# EAGLE design main (EAGLE 6.1)
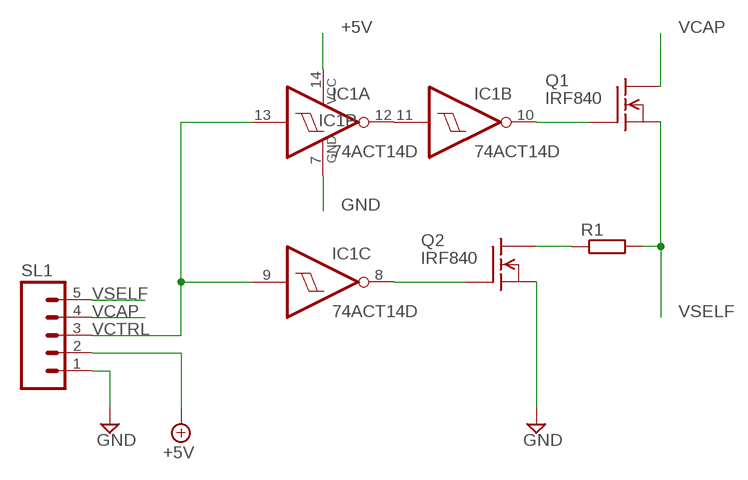
[diagram p0: schematic, sheet 1]

## Parts
IC1  74ACT14D  [SO14]
Q1  IRF840  [TO220]
Q2  IRF840  [TO220]
R1  R-EU_0204/5  [0204/5]
SL1  M05  [05P]

## Nets
+5V: IC1.14(P:VCC) SL1.2
GND: IC1.7(P:GND) Q2.3(S) SL1.1
N$1: IC1.11(B:I) IC1.12(A:O)
N$2: IC1.8(C:O) Q2.1(G)
N$3: IC1.10(B:O) Q1.1(G)
N$6: Q2.2(D) R1.1
VCAP: Q1.2(D) SL1.4
VCTRL: IC1.9(C:I) IC1.13(A:I) SL1.3
VSELF: Q1.3(S) R1.2 SL1.5
Unconnected: IC1.1(D:I) IC1.2(D:O) IC1.3(E:I) IC1.4(E:O) IC1.5(F:I) IC1.6(F:O)

## Library data of the parts
IC1 = 74xx-eu:74*14: Hex schmitt trigger INVERTER
Q1 Q2 = transistor-fet:IRF840: N-Channel Enhancement MOSFET (HEXFET); 500V; 8A; 0,85Ohm
R1 = rcl:R-EU_: RESISTOR, European symbol
SL1 = con-amp-quick:M05: AMP QUICK CONNECTOR; OC_FARNELL: unknown; OC_NEWARK: unknown

## Board
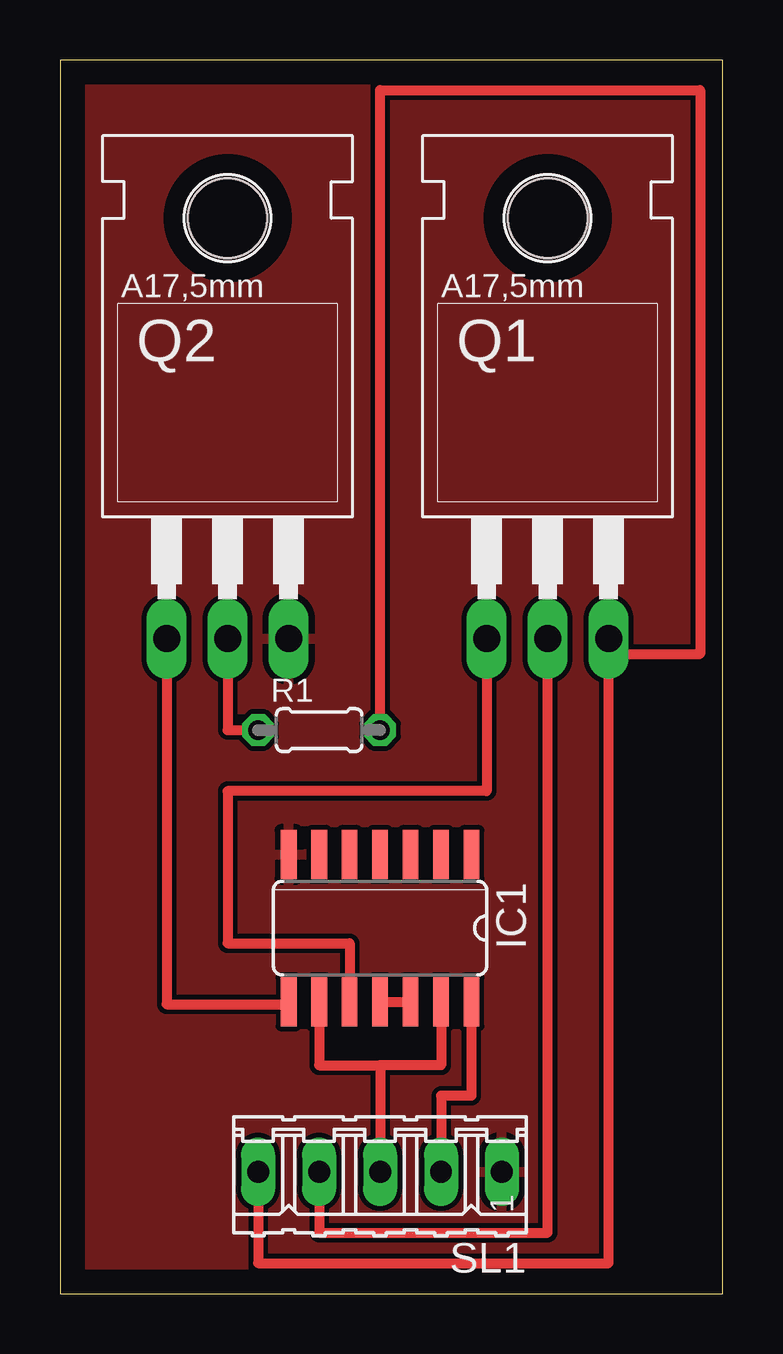
[diagram p1: board, top side]

Size 27.61 x 51.42 mm. Coordinates in mm from the lower left corner, seen from the top.
Outline: 0,0 27.61,0 27.61,51.42 0,51.42 0,0
Copper layers (1*16): Top 0.035mm / dielectric 1.5mm / Bottom 0.035mm
Design rules: minimum track width 10mil, minimum drill 24mil, track to track 8mil, track to pad 8mil, pad to pad 8mil, via to via 8mil, smd to smd 8mil, copper to edge 40mil, drill to drill 8mil, minimum pad ring 10mil, minimum via ring 8mil, stop-mask expansion 4mil, vias tented up to drill 0mil, thermal gap 10mil

### Footprints (pad centres in the part's own frame; a part is rotated, then mirrored left to right if it is on the bottom)
SO14 = smd 0.66 x 2.032: 1 -3.81,-3.073; 2 -2.54,-3.073; 3 -1.27,-3.073; 4 0,-3.073; 5 1.27,-3.073; 6 2.54,-3.073; 7 3.81,-3.073; 8 3.81,3.073; 9 2.54,3.073; 10 1.27,3.073; 11 0,3.073; 12 -1.27,3.073; 13 -2.54,3.073; 14 -3.81,3.073
TO220 = drill 1.118 long: 1 -2.54,-6.35; 2 0,-6.35; 3 2.54,-6.35 | hole 3.302: 0,11.176
0204/5 = drill 0.813 octagon: 1 -2.54,0; 2 2.54,0
05P = drill 0.914 long: 1 -5.08,0; 2 -2.54,0; 3 0,0; 4 2.54,0; 5 5.08,0

### Placement (x,y rotation side)
IC1  13.34,15.24 180 top
Q1  20.32,33.66 0 top
Q2  6.99,33.66 0 top
R1  10.79,23.49 0 top
SL1  13.34,5.08 180 top

### Tracks (layer width: path | path; a pad name or v marks a point on that pad's centre or on a via)
+5V
  Top 0.406: IC1.14 17.14,8.26 15.88,8.26 SL1.2
GND
  pour Top: 0,51.44 27.94,51.44 27.94,0 0,0
N$1
  Top 0.406: IC1.11 IC1.12
N$2
  Top 0.406: Q2.1 4.45,12.07 9.53,12.07 IC1.8
N$3
  Top 0.406: Q1.1 17.78,20.95 6.99,20.95 6.99,14.61 12.06,14.61 IC1.10
N$6
  Top 0.406: Q2.2 6.99,23.49 R1.1
VCAP
  Top 0.406: SL1.4 10.79,2.54 20.32,2.54 Q1.2
VCTRL
  Top 0.406: IC1.13 15.88,9.53 13.34,9.53 | 13.34,9.53 SL1.3 | IC1.9 10.79,9.53 13.34,9.53
VSELF
  Top 0.406: SL1.5 8.26,1.27 22.86,1.27 22.86,26.67 | 22.86,26.67 Q1.3 | R1.2 13.34,50.16 26.67,50.16 26.67,26.67 22.86,26.67